# EasyEDA schematic SCH_Power-Pcb-With-100v-3300uf_2024-05-04.json
TITLE: Sheet_1; REV: 1.0; Date: 2024-04-08; Sheet: 1/1; Drawn By: lesrin15; Company: Your Company
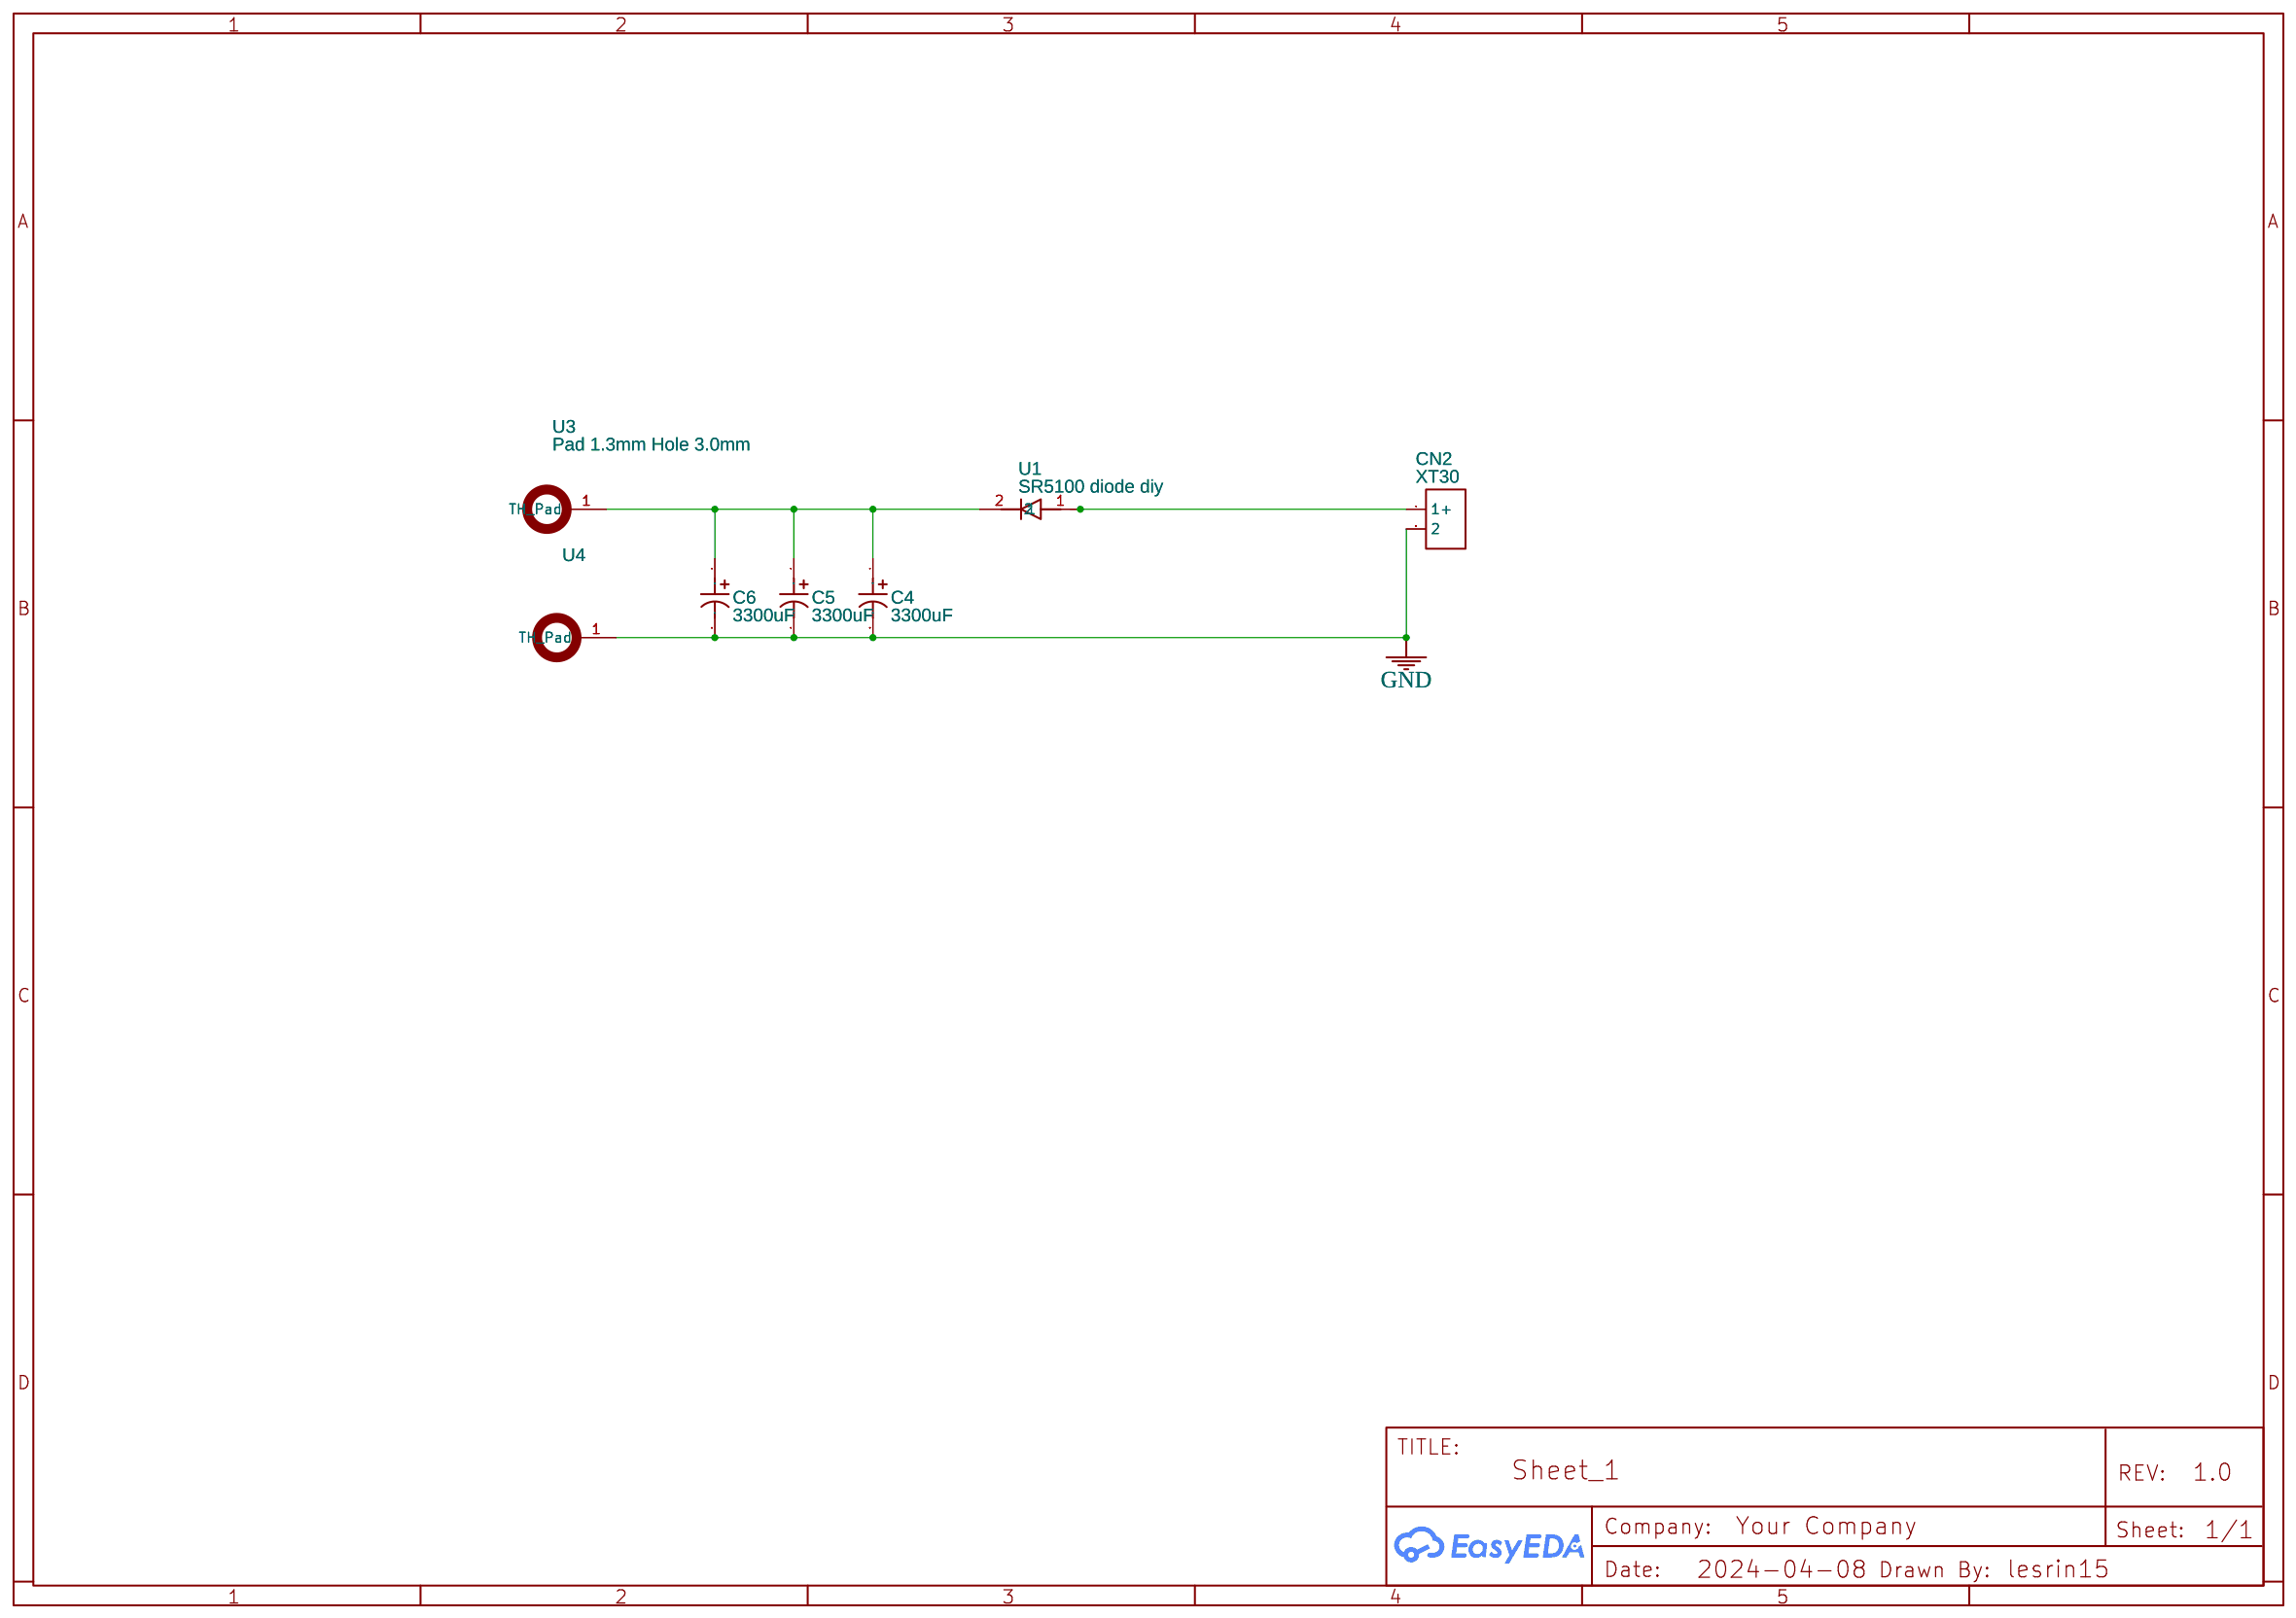
[diagram p0: schematic sheet]

## Parts
C4  3300uF  [CAP-TH_BD22.0-P10.00-D1.0-FD]
C5  3300uF  [CAP-TH_BD22.0-P10.00-D1.0-FD]
C6  3300uF  [CAP-TH_BD22.0-P10.00-D1.0-FD]
CN2  XT30  [CONN-TH_XT30UPB-F]
U1  SR5100 diode diy  [SR5100 FOOTPRINT DIY]
U3  Pad 1.3mm Hole 3.0mm  [THROUGH HOLE PAD 1.7MM HOLE 3.0MM PAD]
U4  Pad 1.3mm Hole 3.0mm  [THROUGH HOLE PAD 1.7MM HOLE 3.0MM PAD]

## Library data of the parts
C4 = CG332MHG40B: Supplier: LCSC; Supplier Part: C911259; Manufacturer: TWBOR(伯鸿); JLCPCB Part Class: Extended Part; Contributor: lcsc; Package Display: No
C5 C6 = CG332MHG40B: Supplier: LCSC; Supplier Part: C911259; Manufacturer: TWBOR(伯鸿); JLCPCB Part Class: Extended Part; Contributor: lcsc
CN2 = XT30UPB-F ARUN: Supplier: LCSC; Supplier Part: C108769; Manufacturer Part: XT30UPB-F; Contributor: LCSC; JLCPCB Part Class: Extended Part
U1 = SR5100 diode diy: Contributor: robocup.evb
U3 U4 = Pad 1.7mm Hole 3.0mm: Contributor: justadequate

## Nets
GND: C4.2 C5.2 C6.2 CN2.2 U4.1(TH Pad)
Net-(C4-1): C4.1 C5.1 C6.1 U1.2 U3.1(TH Pad)
Net-(CN2-1): CN2.1(1+) U1.1
